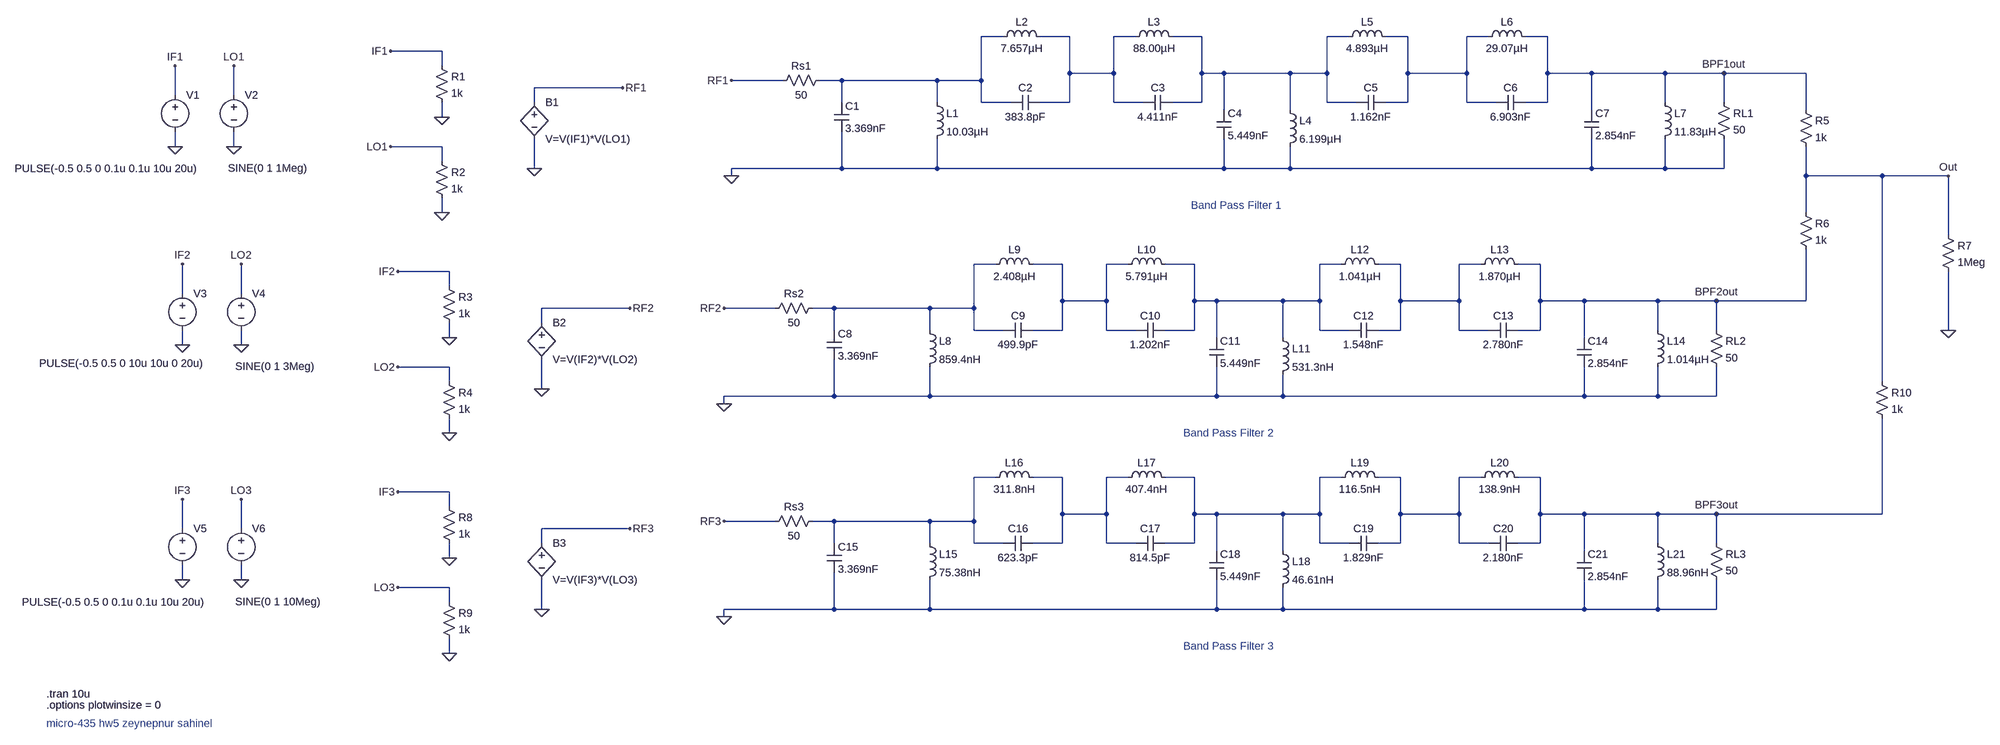
[diagram p0: schematic micro-435 hw5 control3.asc]
micro-435 hw5 control3.asc, the LTspice schematic file:
Version 4
SHEET 1 2536 1240
WIRE 160 -272 112 -272
WIRE 304 -272 240 -272
WIRE 448 -272 400 -272
WIRE 592 -272 528 -272
WIRE 912 -272 864 -272
WIRE 1040 -272 992 -272
WIRE 1216 -272 1168 -272
WIRE 1344 -272 1296 -272
WIRE -1152 -240 -1264 -240
WIRE -1152 -208 -1152 -240
WIRE 304 -192 304 -272
WIRE 400 -192 400 -272
WIRE 400 -192 304 -192
WIRE 592 -192 592 -272
WIRE 640 -192 592 -192
WIRE 784 -192 640 -192
WIRE 864 -192 864 -272
WIRE 864 -192 784 -192
WIRE 1040 -192 1040 -272
WIRE 1168 -192 1168 -272
WIRE 1168 -192 1040 -192
WIRE 1344 -192 1344 -272
WIRE 1440 -192 1344 -192
WIRE 1600 -192 1440 -192
WIRE 1728 -192 1600 -192
WIRE 2112 -192 1728 -192
WIRE -320 -176 -432 -176
WIRE -192 -176 -240 -176
WIRE 16 -176 -192 -176
WIRE 112 -176 112 -272
WIRE 112 -176 16 -176
WIRE -752 -160 -944 -160
WIRE -1856 -144 -1856 -208
WIRE -1728 -144 -1728 -208
WIRE -944 -128 -944 -160
WIRE -192 -128 -192 -176
WIRE 16 -128 16 -176
WIRE 112 -128 112 -176
WIRE 176 -128 112 -128
WIRE 304 -128 304 -192
WIRE 304 -128 240 -128
WIRE 400 -128 400 -192
WIRE 464 -128 400 -128
WIRE 592 -128 592 -192
WIRE 592 -128 528 -128
WIRE 864 -128 864 -192
WIRE 928 -128 864 -128
WIRE 1040 -128 1040 -192
WIRE 1040 -128 992 -128
WIRE 1168 -128 1168 -192
WIRE 1232 -128 1168 -128
WIRE 1344 -128 1344 -192
WIRE 1344 -128 1296 -128
WIRE 1600 -128 1600 -192
WIRE 1728 -128 1728 -192
WIRE 640 -112 640 -192
WIRE 784 -112 784 -192
WIRE 1440 -112 1440 -192
WIRE 2112 -112 2112 -192
WIRE -1152 -96 -1152 -128
WIRE -1856 -32 -1856 -64
WIRE -1728 -32 -1728 -64
WIRE -1152 -32 -1264 -32
WIRE -1152 0 -1152 -32
WIRE -944 16 -944 -48
WIRE -192 16 -192 -64
WIRE -192 16 -432 16
WIRE 16 16 16 -48
WIRE 16 16 -192 16
WIRE 640 16 640 -48
WIRE 640 16 16 16
WIRE 784 16 784 -32
WIRE 784 16 640 16
WIRE 1440 16 1440 -48
WIRE 1440 16 784 16
WIRE 1600 16 1600 -48
WIRE 1600 16 1440 16
WIRE 1728 16 1728 -48
WIRE 1728 16 1600 16
WIRE -432 32 -432 16
WIRE 2112 32 2112 -32
WIRE 2304 32 2112 32
WIRE 2448 32 2304 32
WIRE -1152 112 -1152 80
WIRE 2112 112 2112 32
WIRE 2448 160 2448 32
WIRE 144 224 96 224
WIRE 288 224 224 224
WIRE 432 224 384 224
WIRE 576 224 512 224
WIRE 896 224 848 224
WIRE 1024 224 976 224
WIRE 1200 224 1152 224
WIRE 1328 224 1280 224
WIRE -1136 240 -1248 240
WIRE -1136 272 -1136 240
WIRE -1840 288 -1840 224
WIRE -1712 288 -1712 224
WIRE 288 304 288 224
WIRE 384 304 384 224
WIRE 384 304 288 304
WIRE 576 304 576 224
WIRE 624 304 576 304
WIRE 768 304 624 304
WIRE 848 304 848 224
WIRE 848 304 768 304
WIRE 1024 304 1024 224
WIRE 1152 304 1152 224
WIRE 1152 304 1024 304
WIRE 1328 304 1328 224
WIRE 1424 304 1328 304
WIRE 1584 304 1424 304
WIRE 1712 304 1584 304
WIRE 2112 304 2112 192
WIRE 2112 304 1712 304
WIRE -736 320 -928 320
WIRE -336 320 -448 320
WIRE -208 320 -256 320
WIRE 0 320 -208 320
WIRE 96 320 96 224
WIRE 96 320 0 320
WIRE -928 352 -928 320
WIRE -208 368 -208 320
WIRE 0 368 0 320
WIRE 96 368 96 320
WIRE 160 368 96 368
WIRE 288 368 288 304
WIRE 288 368 224 368
WIRE 384 368 384 304
WIRE 448 368 384 368
WIRE 576 368 576 304
WIRE 576 368 512 368
WIRE 848 368 848 304
WIRE 912 368 848 368
WIRE 1024 368 1024 304
WIRE 1024 368 976 368
WIRE 1152 368 1152 304
WIRE 1216 368 1152 368
WIRE 1328 368 1328 304
WIRE 1328 368 1280 368
WIRE 1584 368 1584 304
WIRE 1712 368 1712 304
WIRE 2448 368 2448 240
WIRE -1136 384 -1136 352
WIRE 624 384 624 304
WIRE 768 384 768 304
WIRE 1424 384 1424 304
WIRE -1840 400 -1840 368
WIRE -1712 400 -1712 368
WIRE -1136 448 -1248 448
WIRE -1136 480 -1136 448
WIRE 2304 480 2304 32
WIRE -928 496 -928 432
WIRE -208 512 -208 432
WIRE -208 512 -448 512
WIRE 0 512 0 448
WIRE 0 512 -208 512
WIRE 624 512 624 448
WIRE 624 512 0 512
WIRE 768 512 768 464
WIRE 768 512 624 512
WIRE 1424 512 1424 448
WIRE 1424 512 768 512
WIRE 1584 512 1584 448
WIRE 1584 512 1424 512
WIRE 1712 512 1712 448
WIRE 1712 512 1584 512
WIRE -448 528 -448 512
WIRE -1136 592 -1136 560
WIRE 144 688 96 688
WIRE 288 688 224 688
WIRE 432 688 384 688
WIRE 576 688 512 688
WIRE 896 688 848 688
WIRE 1024 688 976 688
WIRE 1200 688 1152 688
WIRE 1328 688 1280 688
WIRE -1136 720 -1248 720
WIRE -1136 752 -1136 720
WIRE 288 768 288 688
WIRE 384 768 384 688
WIRE 384 768 288 768
WIRE 576 768 576 688
WIRE 624 768 576 768
WIRE 768 768 624 768
WIRE 848 768 848 688
WIRE 848 768 768 768
WIRE 1024 768 1024 688
WIRE 1152 768 1152 688
WIRE 1152 768 1024 768
WIRE 1328 768 1328 688
WIRE 1424 768 1328 768
WIRE 1584 768 1424 768
WIRE 1712 768 1584 768
WIRE 2304 768 2304 560
WIRE 2304 768 1712 768
WIRE -336 784 -448 784
WIRE -208 784 -256 784
WIRE 0 784 -208 784
WIRE 96 784 96 688
WIRE 96 784 0 784
WIRE -1840 800 -1840 736
WIRE -1712 800 -1712 736
WIRE -736 800 -928 800
WIRE -928 832 -928 800
WIRE -208 832 -208 784
WIRE 0 832 0 784
WIRE 96 832 96 784
WIRE 160 832 96 832
WIRE 288 832 288 768
WIRE 288 832 224 832
WIRE 384 832 384 768
WIRE 448 832 384 832
WIRE 576 832 576 768
WIRE 576 832 512 832
WIRE 848 832 848 768
WIRE 912 832 848 832
WIRE 1024 832 1024 768
WIRE 1024 832 976 832
WIRE 1152 832 1152 768
WIRE 1216 832 1152 832
WIRE 1328 832 1328 768
WIRE 1328 832 1280 832
WIRE 1584 832 1584 768
WIRE 1712 832 1712 768
WIRE 624 848 624 768
WIRE 768 848 768 768
WIRE 1424 848 1424 768
WIRE -1136 864 -1136 832
WIRE -1840 912 -1840 880
WIRE -1712 912 -1712 880
WIRE -1136 928 -1248 928
WIRE -1136 960 -1136 928
WIRE -928 976 -928 912
WIRE -208 976 -208 896
WIRE -208 976 -448 976
WIRE 0 976 0 912
WIRE 0 976 -208 976
WIRE 624 976 624 912
WIRE 624 976 0 976
WIRE 768 976 768 928
WIRE 768 976 624 976
WIRE 1424 976 1424 912
WIRE 1424 976 768 976
WIRE 1584 976 1584 912
WIRE 1584 976 1424 976
WIRE 1712 976 1712 912
WIRE 1712 976 1584 976
WIRE -448 992 -448 976
WIRE -1136 1072 -1136 1040
FLAG -432 32 0
FLAG 1728 -192 BPF1out
FLAG -448 528 0
FLAG 1712 304 BPF2out
FLAG -1152 -96 0
FLAG -1264 -240 IF1
FLAG -1152 112 0
FLAG -1264 -32 LO1
FLAG -944 16 0
FLAG -752 -160 RF1
FLAG -1856 -32 0
FLAG -1728 -32 0
FLAG -1856 -208 IF1
FLAG -1728 -208 LO1
FLAG -1136 384 0
FLAG -1248 240 IF2
FLAG -1136 592 0
FLAG -1248 448 LO2
FLAG -928 496 0
FLAG -736 320 RF2
FLAG -1840 400 0
FLAG -1712 400 0
FLAG -1840 224 IF2
FLAG -1712 224 LO2
FLAG -432 -176 RF1
FLAG -448 320 RF2
FLAG 2448 368 0
FLAG 2448 32 Out
FLAG -1136 864 0
FLAG -1248 720 IF3
FLAG -1136 1072 0
FLAG -1248 928 LO3
FLAG -928 976 0
FLAG -736 800 RF3
FLAG -1840 912 0
FLAG -1712 912 0
FLAG -1840 736 IF3
FLAG -1712 736 LO3
FLAG -448 992 0
FLAG 1712 768 BPF3out
FLAG -448 784 RF3
SYMBOL res -224 -192 R90
WINDOW 0 0 56 VBottom 2
WINDOW 3 32 56 VTop 2
SYMATTR InstName Rs1
SYMATTR Value 50
SYMBOL cap -208 -128 R0
SYMATTR InstName C1
SYMATTR Value 3.369nF
SYMBOL ind 0 -144 R0
SYMATTR InstName L1
SYMATTR Value 10.03µH
SYMBOL ind 144 -256 R270
WINDOW 0 32 56 VTop 2
WINDOW 3 5 56 VBottom 2
SYMATTR InstName L2
SYMATTR Value 7.657µH
SYMBOL cap 240 -144 R90
WINDOW 0 0 32 VBottom 2
WINDOW 3 32 32 VTop 2
SYMATTR InstName C2
SYMATTR Value 383.8pF
SYMBOL ind 432 -256 R270
WINDOW 0 32 56 VTop 2
WINDOW 3 5 56 VBottom 2
SYMATTR InstName L3
SYMATTR Value 88.00µH
SYMBOL cap 464 -112 R270
WINDOW 0 32 32 VTop 2
WINDOW 3 0 32 VBottom 2
SYMATTR InstName C3
SYMATTR Value 4.411nF
SYMBOL cap 624 -112 R0
SYMATTR InstName C4
SYMATTR Value 5.449nF
SYMBOL ind 768 -128 R0
SYMATTR InstName L4
SYMATTR Value 6.199µH
SYMBOL ind 896 -256 R270
WINDOW 0 32 56 VTop 2
WINDOW 3 5 56 VBottom 2
SYMATTR InstName L5
SYMATTR Value 4.893µH
SYMBOL cap 992 -144 R90
WINDOW 0 0 32 VBottom 2
WINDOW 3 32 32 VTop 2
SYMATTR InstName C5
SYMATTR Value 1.162nF
SYMBOL ind 1200 -256 R270
WINDOW 0 32 56 VTop 2
WINDOW 3 5 56 VBottom 2
SYMATTR InstName L6
SYMATTR Value 29.07µH
SYMBOL cap 1232 -112 R270
WINDOW 0 32 32 VTop 2
WINDOW 3 0 32 VBottom 2
SYMATTR InstName C6
SYMATTR Value 6.903nF
SYMBOL cap 1424 -112 R0
SYMATTR InstName C7
SYMATTR Value 2.854nF
SYMBOL ind 1584 -144 R0
SYMATTR InstName L7
SYMATTR Value 11.83µH
SYMBOL res 1712 -144 R0
SYMATTR InstName RL1
SYMATTR Value 50
SYMBOL res -240 304 R90
WINDOW 0 0 56 VBottom 2
WINDOW 3 32 56 VTop 2
SYMATTR InstName Rs2
SYMATTR Value 50
SYMBOL cap -224 368 R0
SYMATTR InstName C8
SYMATTR Value 3.369nF
SYMBOL ind -16 352 R0
SYMATTR InstName L8
SYMATTR Value 859.4nH
SYMBOL ind 128 240 R270
WINDOW 0 32 56 VTop 2
WINDOW 3 5 56 VBottom 2
SYMATTR InstName L9
SYMATTR Value 2.408µH
SYMBOL cap 224 352 R90
WINDOW 0 0 32 VBottom 2
WINDOW 3 32 32 VTop 2
SYMATTR InstName C9
SYMATTR Value 499.9pF
SYMBOL ind 416 240 R270
WINDOW 0 32 56 VTop 2
WINDOW 3 5 56 VBottom 2
SYMATTR InstName L10
SYMATTR Value 5.791µH
SYMBOL cap 448 384 R270
WINDOW 0 32 32 VTop 2
WINDOW 3 0 32 VBottom 2
SYMATTR InstName C10
SYMATTR Value 1.202nF
SYMBOL cap 608 384 R0
SYMATTR InstName C11
SYMATTR Value 5.449nF
SYMBOL ind 752 368 R0
SYMATTR InstName L11
SYMATTR Value 531.3nH
SYMBOL ind 880 240 R270
WINDOW 0 32 56 VTop 2
WINDOW 3 5 56 VBottom 2
SYMATTR InstName L12
SYMATTR Value 1.041µH
SYMBOL cap 976 352 R90
WINDOW 0 0 32 VBottom 2
WINDOW 3 32 32 VTop 2
SYMATTR InstName C12
SYMATTR Value 1.548nF
SYMBOL ind 1184 240 R270
WINDOW 0 32 56 VTop 2
WINDOW 3 5 56 VBottom 2
SYMATTR InstName L13
SYMATTR Value 1.870µH
SYMBOL cap 1216 384 R270
WINDOW 0 32 32 VTop 2
WINDOW 3 0 32 VBottom 2
SYMATTR InstName C13
SYMATTR Value 2.780nF
SYMBOL cap 1408 384 R0
SYMATTR InstName C14
SYMATTR Value 2.854nF
SYMBOL ind 1568 352 R0
SYMATTR InstName L14
SYMATTR Value 1.014µH
SYMBOL res 1696 352 R0
SYMATTR InstName RL2
SYMATTR Value 50
SYMBOL bv -944 -144 R0
SYMATTR InstName B1
SYMATTR Value V=V(IF1)*V(LO1)
SYMBOL res -1168 -224 R0
SYMATTR InstName R1
SYMATTR Value 1k
SYMBOL res -1168 -16 R0
SYMATTR InstName R2
SYMATTR Value 1k
SYMBOL voltage -1856 -160 R0
WINDOW 3 -349 176 Left 2
WINDOW 123 0 0 Left 0
WINDOW 39 0 0 Left 0
SYMATTR Value PULSE(-0.5 0.5 0 0.1u 0.1u 10u 20u)
SYMATTR InstName V1
SYMBOL voltage -1728 -160 R0
WINDOW 3 -13 175 Left 2
WINDOW 123 0 0 Left 0
WINDOW 39 0 0 Left 0
SYMATTR Value SINE(0 1 1Meg)
SYMATTR InstName V2
SYMBOL bv -928 336 R0
SYMATTR InstName B2
SYMATTR Value V=V(IF2)*V(LO2)
SYMBOL res -1152 256 R0
SYMATTR InstName R3
SYMATTR Value 1k
SYMBOL res -1152 464 R0
SYMATTR InstName R4
SYMATTR Value 1k
SYMBOL voltage -1840 272 R0
WINDOW 3 -312 168 Left 2
WINDOW 123 0 0 Left 0
WINDOW 39 0 0 Left 0
SYMATTR Value PULSE(-0.5 0.5 0 10u 10u 0 20u)
SYMATTR InstName V3
SYMBOL voltage -1712 272 R0
WINDOW 3 -13 175 Left 2
WINDOW 123 0 0 Left 0
WINDOW 39 0 0 Left 0
SYMATTR Value SINE(0 1 3Meg)
SYMATTR InstName V4
SYMBOL res 2096 -128 R0
SYMATTR InstName R5
SYMATTR Value 1k
SYMBOL res 2096 96 R0
SYMATTR InstName R6
SYMATTR Value 1k
SYMBOL res 2432 144 R0
SYMATTR InstName R7
SYMATTR Value 1Meg
SYMBOL bv -928 816 R0
SYMATTR InstName B3
SYMATTR Value V=V(IF3)*V(LO3)
SYMBOL res -1152 736 R0
SYMATTR InstName R8
SYMATTR Value 1k
SYMBOL res -1152 944 R0
SYMATTR InstName R9
SYMATTR Value 1k
SYMBOL voltage -1840 784 R0
WINDOW 3 -349 176 Left 2
WINDOW 123 0 0 Left 0
WINDOW 39 0 0 Left 0
SYMATTR Value PULSE(-0.5 0.5 0 0.1u 0.1u 10u 20u)
SYMATTR InstName V5
SYMBOL voltage -1712 784 R0
WINDOW 3 -13 175 Left 2
WINDOW 123 0 0 Left 0
WINDOW 39 0 0 Left 0
SYMATTR Value SINE(0 1 10Meg)
SYMATTR InstName V6
SYMBOL res -240 768 R90
WINDOW 0 0 56 VBottom 2
WINDOW 3 32 56 VTop 2
SYMATTR InstName Rs3
SYMATTR Value 50
SYMBOL cap -224 832 R0
SYMATTR InstName C15
SYMATTR Value 3.369nF
SYMBOL ind -16 816 R0
SYMATTR InstName L15
SYMATTR Value 75.38nH
SYMBOL ind 128 704 R270
WINDOW 0 32 56 VTop 2
WINDOW 3 5 56 VBottom 2
SYMATTR InstName L16
SYMATTR Value 311.8nH
SYMBOL cap 224 816 R90
WINDOW 0 0 32 VBottom 2
WINDOW 3 32 32 VTop 2
SYMATTR InstName C16
SYMATTR Value 623.3pF
SYMBOL ind 416 704 R270
WINDOW 0 32 56 VTop 2
WINDOW 3 5 56 VBottom 2
SYMATTR InstName L17
SYMATTR Value 407.4nH
SYMBOL cap 448 848 R270
WINDOW 0 32 32 VTop 2
WINDOW 3 0 32 VBottom 2
SYMATTR InstName C17
SYMATTR Value 814.5pF
SYMBOL cap 608 848 R0
SYMATTR InstName C18
SYMATTR Value 5.449nF
SYMBOL ind 752 832 R0
SYMATTR InstName L18
SYMATTR Value 46.61nH
SYMBOL ind 880 704 R270
WINDOW 0 32 56 VTop 2
WINDOW 3 5 56 VBottom 2
SYMATTR InstName L19
SYMATTR Value 116.5nH
SYMBOL cap 976 816 R90
WINDOW 0 0 32 VBottom 2
WINDOW 3 32 32 VTop 2
SYMATTR InstName C19
SYMATTR Value 1.829nF
SYMBOL ind 1184 704 R270
WINDOW 0 32 56 VTop 2
WINDOW 3 5 56 VBottom 2
SYMATTR InstName L20
SYMATTR Value 138.9nH
SYMBOL cap 1216 848 R270
WINDOW 0 32 32 VTop 2
WINDOW 3 0 32 VBottom 2
SYMATTR InstName C20
SYMATTR Value 2.180nF
SYMBOL cap 1408 848 R0
SYMATTR InstName C21
SYMATTR Value 2.854nF
SYMBOL ind 1568 816 R0
SYMATTR InstName L21
SYMATTR Value 88.96nH
SYMBOL res 1696 816 R0
SYMATTR InstName RL3
SYMATTR Value 50
SYMBOL res 2288 464 R0
SYMATTR InstName R10
SYMATTR Value 1k
TEXT 568 96 Left 2 ;Band Pass Filter 1
TEXT 552 592 Left 2 ;Band Pass Filter 2
TEXT -2136 1224 Left 2 ;micro-435 hw5 zeynepnur sahinel
TEXT -2136 1160 Left 2 !.tran 10u
TEXT -2136 1184 Left 2 !.options plotwinsize = 0
TEXT 552 1056 Left 2 ;Band Pass Filter 3

The netlist it stands for:
* micro-435 hw5 control3.asc
Rs1 N001 RF1 50
C1 N001 0 3.369nF
L1 N001 0 10.03µH
L2 N001 N002 7.657µH
C2 N002 N001 383.8pF
L3 N002 N003 88.00µH
C3 N002 N003 4.411nF
C4 N003 0 5.449nF
L4 N003 0 6.199µH
L5 N003 N004 4.893µH
C5 N004 N003 1.162nF
L6 N004 BPF1out 29.07µH
C6 N004 BPF1out 6.903nF
C7 BPF1out 0 2.854nF
L7 BPF1out 0 11.83µH
RL1 BPF1out 0 50
Rs2 N005 RF2 50
C8 N005 0 3.369nF
L8 N005 0 859.4nH
L9 N005 N006 2.408µH
C9 N006 N005 499.9pF
L10 N006 N007 5.791µH
C10 N006 N007 1.202nF
C11 N007 0 5.449nF
L11 N007 0 531.3nH
L12 N007 N008 1.041µH
C12 N008 N007 1.548nF
L13 N008 BPF2out 1.870µH
C13 N008 BPF2out 2.780nF
C14 BPF2out 0 2.854nF
L14 BPF2out 0 1.014µH
RL2 BPF2out 0 50
B1 RF1 0 V=V(IF1)*V(LO1)
R1 IF1 0 1k
R2 LO1 0 1k
V1 IF1 0 PULSE(-0.5 0.5 0 0.1u 0.1u 10u 20u)
V2 LO1 0 SINE(0 1 1Meg)
B2 RF2 0 V=V(IF2)*V(LO2)
R3 IF2 0 1k
R4 LO2 0 1k
V3 IF2 0 PULSE(-0.5 0.5 0 10u 10u 0 20u)
V4 LO2 0 SINE(0 1 3Meg)
R5 BPF1out Out 1k
R6 Out BPF2out 1k
R7 Out 0 1Meg
B3 RF3 0 V=V(IF3)*V(LO3)
R8 IF3 0 1k
R9 LO3 0 1k
V5 IF3 0 PULSE(-0.5 0.5 0 0.1u 0.1u 10u 20u)
V6 LO3 0 SINE(0 1 10Meg)
Rs3 N009 RF3 50
C15 N009 0 3.369nF
L15 N009 0 75.38nH
L16 N009 N010 311.8nH
C16 N010 N009 623.3pF
L17 N010 N011 407.4nH
C17 N010 N011 814.5pF
C18 N011 0 5.449nF
L18 N011 0 46.61nH
L19 N011 N012 116.5nH
C19 N012 N011 1.829nF
L20 N012 BPF3out 138.9nH
C20 N012 BPF3out 2.180nF
C21 BPF3out 0 2.854nF
L21 BPF3out 0 88.96nH
RL3 BPF3out 0 50
R10 Out BPF3out 1k
* Band Pass Filter 1
* Band Pass Filter 2
* micro-435 hw5 zeynepnur sahinel
.tran 10u
.options plotwinsize = 0
* Band Pass Filter 3
.backanno
.end